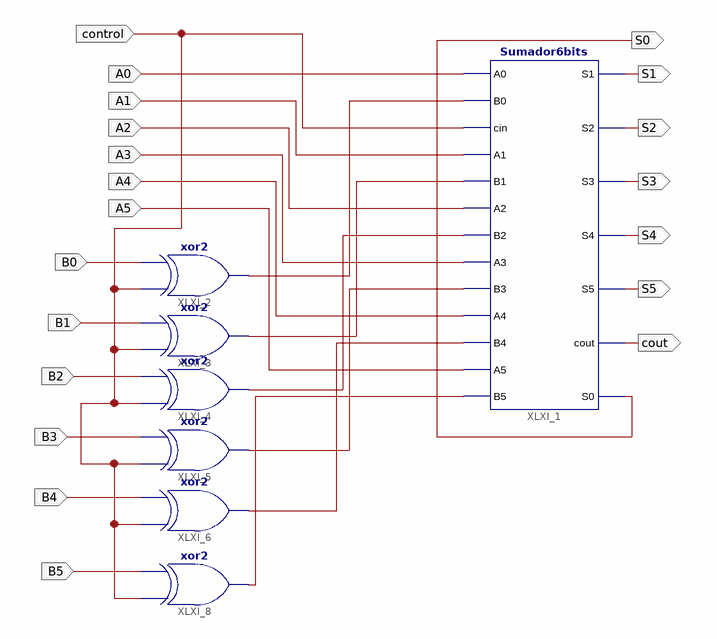
[diagram p0: schematic sheet 1]
// Xilinx ISE schematic SumadorRestador6bits.sch (spartan3e) as structural Verilog: 7 symbols, 20 ports
module SumadorRestador6bits (
  input  A0,
  input  A2,
  input  A3,
  input  A4,
  input  A5,
  input  A1,
  input  control,
  input  B0,
  input  B1,
  input  B2,
  input  B3,
  input  B4,
  input  B5,
  output S0,
  output cout,
  output S5,
  output S4,
  output S3,
  output S2,
  output S1
);

  wire XLXN_27, XLXN_28, XLXN_29, XLXN_30, XLXN_31, XLXN_37;

  Sumador6bits XLXI_1 (
    .A0(A0), .B0(XLXN_27), .cin(control), .A1(A1), .B1(XLXN_28), .A2(A2), .B2(XLXN_29), .A3(A3),
    .B3(XLXN_30), .A4(A4), .B4(XLXN_31), .A5(A5), .B5(XLXN_37), .S1(S1), .S2(S2), .S3(S3), .S4(S4), .S5(S5),
    .cout(cout), .S0(S0));
  xor XLXI_2 (XLXN_27, control, B0);
  xor XLXI_3 (XLXN_28, control, B1);
  xor XLXI_4 (XLXN_29, control, B2);
  xor XLXI_5 (XLXN_30, control, B3);
  xor XLXI_6 (XLXN_31, control, B4);
  xor XLXI_8 (XLXN_37, control, B5);
endmodule
